# EAGLE design TransmissorTori (EAGLE 9.6.2)
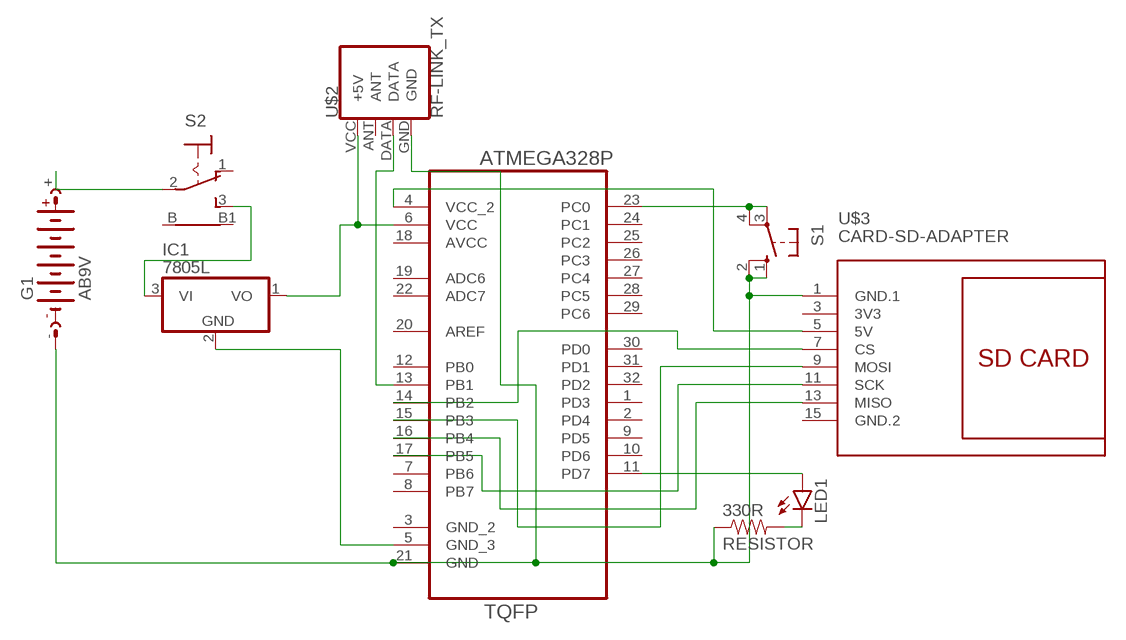
[diagram p0: schematic, sheet 1]

## Parts
330R  RESISTOR  [0603RES]
G1  AB9V  [AB9V]
IC1  7805L  [TO92]
LED1  LED5MM  [LED5MM]
S1  10-XX  [B3F-10XX]
S2  9070-1W  [9070-1W]
U1  ATMEGA328P-AU  [QFP80P900X900X120-32N]
U$2  RF-LINK_TX  [RF-LINK_TX]
U$3  CARD-SD-ADAPTER  [CARD-SD-ADAPTER]

## Nets
N$1: G1.+ S2.2(P)
N$2: IC1.1(VO) U1.6(VCC) U$2.VCC(+5V)
N$3: 330R.1 G1.- S1.1(S) S1.2(S1) U1.21(GND) U$2.GND U$3.1(GND.1)
N$4: U1.15(PB3) U$3.9(MOSI)
N$5: U1.17(PB5) U$3.11(SCK)
N$6: U1.16(PB4) U$3.13(MISO)
N$7: U1.14(PB2) U$3.7(CS)
N$8: U1.4(VCC_2) U$3.5(5V)
N$9: U1.13(PB1) U$2.DATA
N$10: IC1.2(GND) U1.5(GND_3)
N$11: IC1.3(VI) S2.3(S)
N$12: 330R.2 LED1.K(C)
N$13: LED1.A U1.11(PD7)
N$14: S1.3(P) S1.4(P1) U1.23(PC0)
Unconnected: S2.1(O) S2.B S2.B1 U1.1(PD3) U1.2(PD4) U1.3(GND_2) U1.7(PB6) U1.8(PB7) U1.9(PD5) U1.10(PD6) U1.12(PB0) U1.19(ADC6) U1.20(AREF) U1.22(ADC7) U1.24(PC1) U1.25(PC2) U1.26(PC3) U1.27(PC4) U1.28(PC5) U1.29(PC6) U1.30(PD0) U1.31(PD1) U1.32(PD2) U$2.ANT

## Power pins joined to a net without a drawn wire
3V3: U$3.3(3V3)
AVCC: U1.18(AVCC)
GND.2: U$3.15(GND.2)

## Library data of the parts
330R = Ava:RESISTOR
G1 = battery:AB9V: 9-V BATTERY CLIP
IC1 = linear:78*: Positive VOLTAGE REGULATOR Source: http://cache.national.com/ds/LM/LM78L05.pdf http://www.fairchildsemi.com/ds/LM/LM7805.pdf
LED1 = led:LED: LED OSRAM: - CHIPLED LG R971, LG N971, LY N971, LG Q971, LY Q971, LO R971, LY R971 LH N974, LH R974 LS Q976, LO Q976, LY Q976 LO Q996 - Hyper CHIPLED LW Q18S LB Q993, LB Q99A, LB R99A - SideLED LS A670, LO A670, LY A670, LG A670, LP A670 LB A673, LV A673, LT A673, LW A673 LH A674 LY A675 LS A676, LA A676, LO A676, LY A676, LW A676 LS A679, LY A679, LG A679 - Hyper Micro SIDELED® LS Y876, LA Y876, LO Y876, LY Y876 LT Y87S - SmartLED LW L88C, LW L88S LB L89C, LB L89S, LG L890 LS L89K, LO L89K, LY L89K LS L896, LA L896, LO L896, LY L896 - TOPLED LS T670, LO T670, LY T670, LG T670, LP T670 LSG T670, LSP T670, LSY T670, LOP T670, LYG T670 LG T671, LOG T671, LSG T671 LB T673, LV T673, LT T673, LW T673 LH T674 LS T676, LA T676, LO T676, LY T676, LB T676, LH T676, LSB T676, LW T676 LB T67C, LV T67C, LT T67C, LS T67K, LO T67K, LY T67K, LW E67C LS E67B, LA E67B, LO E67B, LY E67B, LB E67C, LV E67C, LT E67C LW T67C LS T679, LY T679, LG T679 LS T770, LO T770, LY T770, LG T770, LP T770 LB T773, LV T773, LT T773, LW T773 LH T774 LS E675, LA E675, LY E675, LS T675 LS T776, LA T776, LO T776, LY T776, LB T776 LHGB T686 LT T68C, LB T68C - Hyper Mini TOPLED® LB M676 - Mini TOPLED Santana® LG M470 LS M47K, LO M47K, LY M47K Source: http://www.osram.convergy.de LUXEON: - LUMILED® LXK2-PW12-R00, LXK2-PW12-S00, LXK2-PW14-U00, LXK2-PW14-V00 LXK2-PM12-R00, LXK2-PM12-S00, LXK2-PM14-U00 LXK2-PE12-Q00, LXK2-PE12-R00, LXK2-PE12-S00, LXK2-PE14-T00, LXK2-PE14-U00 LXK2-PB12-K00, LXK2-PB12-L00, LXK2-PB12-M00, LXK2-PB14-N00, LXK2-PB14-P00, LXK2-PB14-Q00 LXK2-PR12-L00, LXK2-PR12-M00, LXK2-PR14-Q00, LXK2-PR14-R00 LXK2-PD12-Q00, LXK2-PD12-R00, LXK2-PD12-S00 LXK2-PH12-R00, LXK2-PH12-S00 LXK2-PL12-P00, LXK2-PL12-Q00, LXK2-PL12-R00 Source: www.luxeon.com KINGBRIGHT: KA-3528ASYC Source: www.kingbright.com
S1 = switch-omron:10-XX: OMRON SWITCH; MPN: B3F-1000; OC_FARNELL: 176432; OC_NEWARK: 36M3542
S2 = switch:9070-1W: TOGGLE SWITCH Marquardt
U1 = Ava:ATMEGA328P-AU; DESCRIPTION: 8-bit Microcontroller with In-System Programmable Flash; MPN: ATMEGA328P-AU; OC_FARNELL: 1715486; OC_NEWARK: 14R4631; PACKAGE: TQFP-32; SUPPLIER: Atmel
U$2 = SparkFun-RF:RF-LINK_TX: RF Link Transmitter (434 MHz, 315 MHz) These wireless transmitters work with equivalent receivers. They can easily fit into a breadboard and work well with microcontrollers to create a very simple wireless data link. Since these are only transmitters, they will only work communicating data one-way, you would need two pairs (of different frequencies) to act as a transmitter/receiver pair. SparkFun Products RF Link Transmitter - 434MHz <https://www.sparkfun.com/products/10534> (WRL-10534); SF_ID: WRL-10534
U$3 = diy-modules:CARD-SD-ADAPTER: Full Size SD Card Adapter Module with onboard 3.3V regulator

## Board
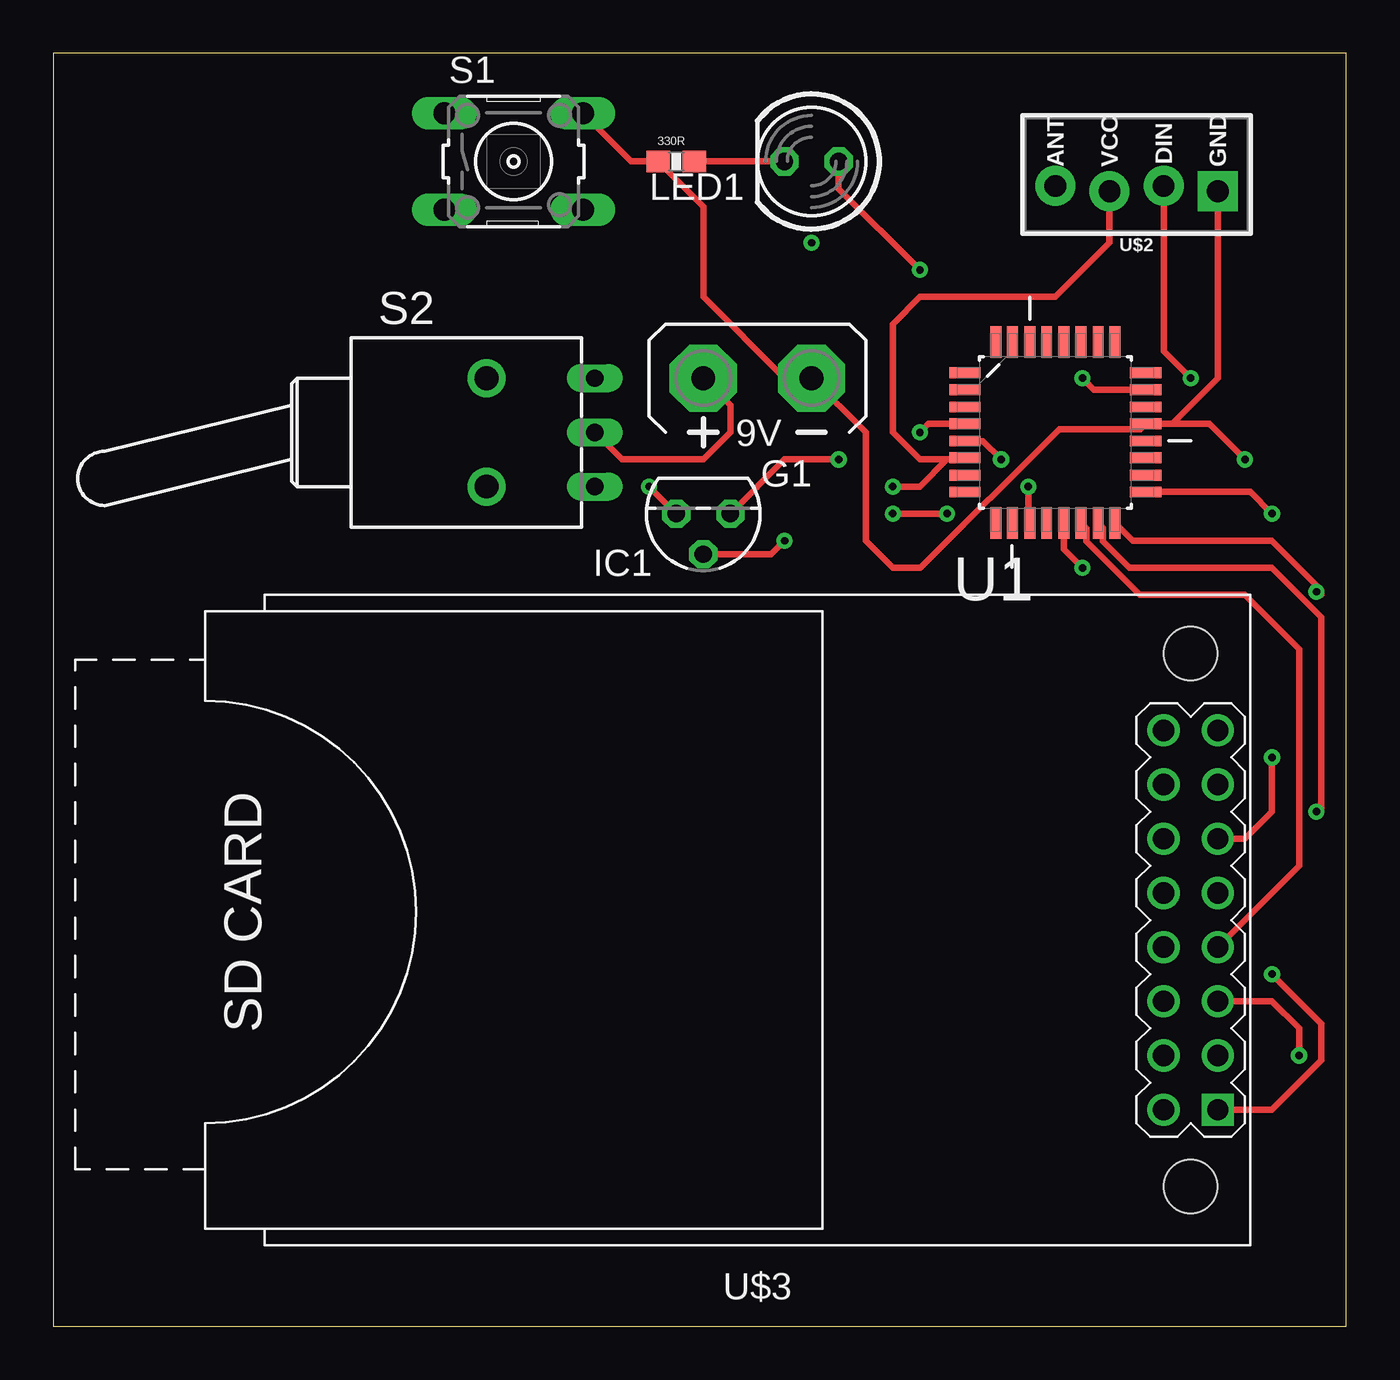
[diagram p1: board, top side]
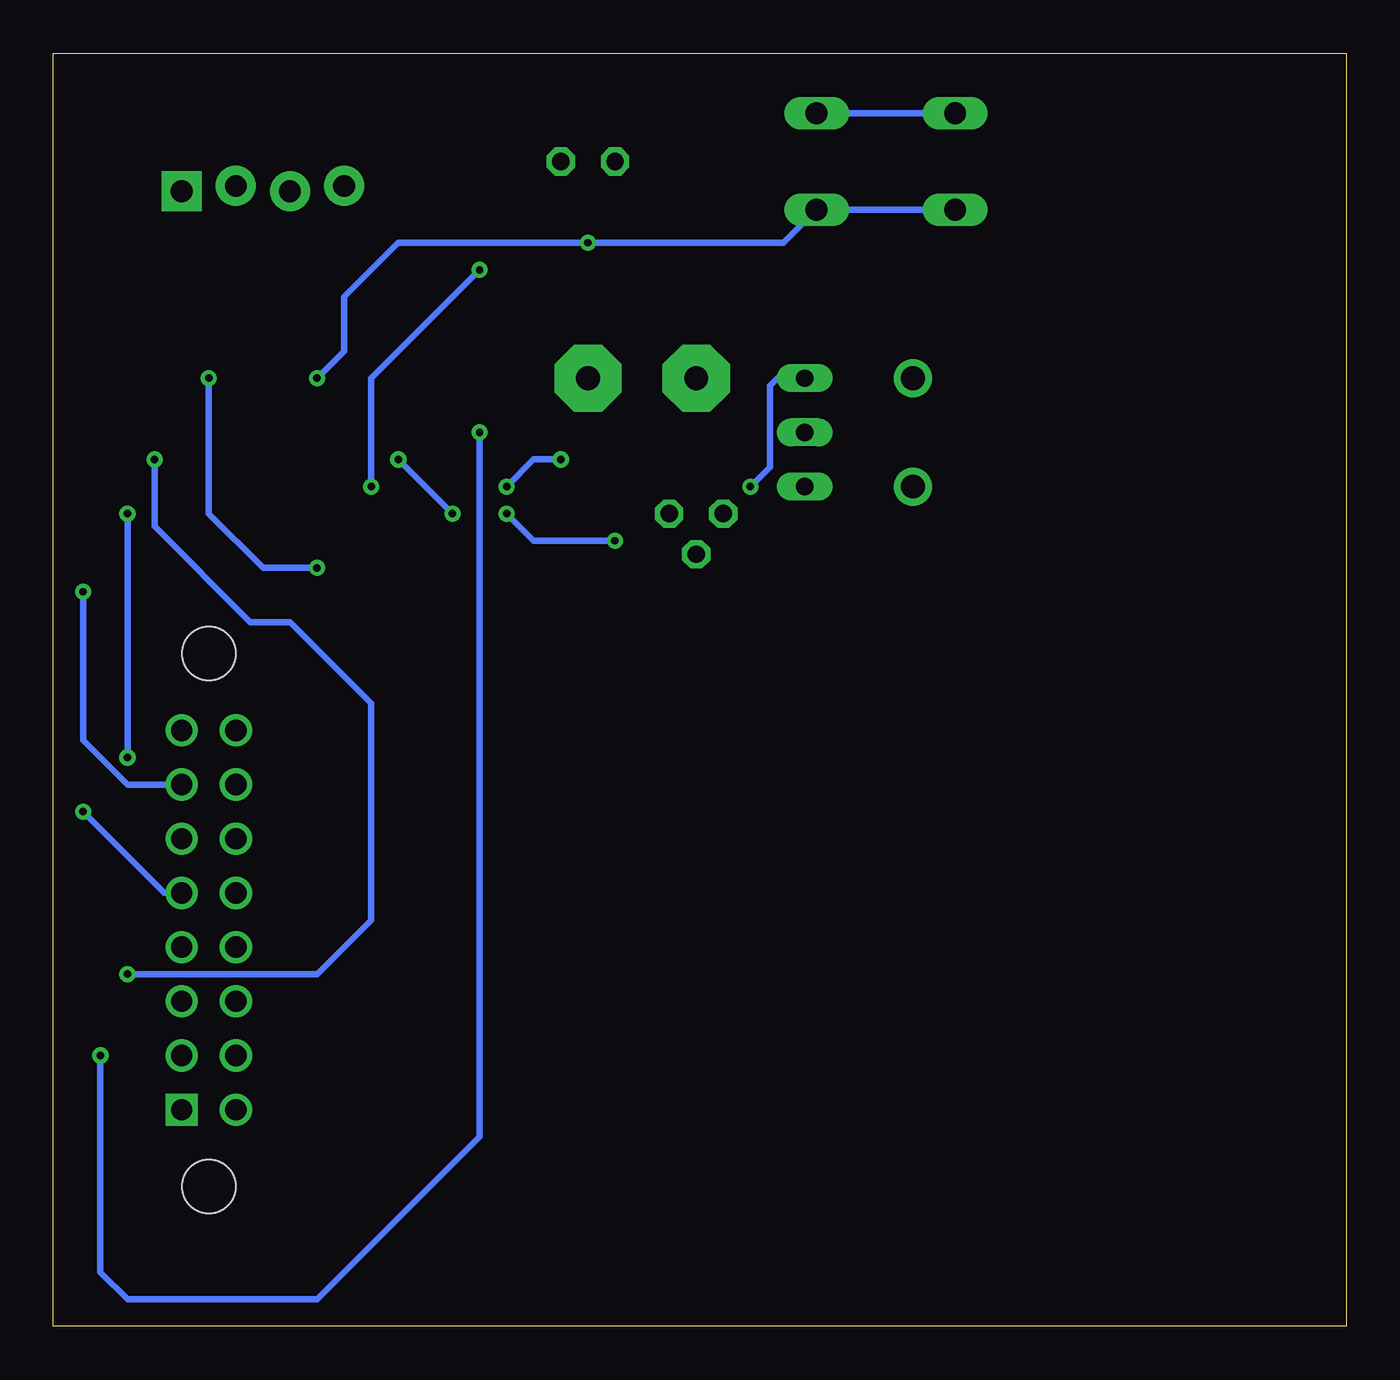
[diagram p2: board, bottom side, seen from below]

Size 60.63 x 59.68 mm. Coordinates in mm from the lower left corner, seen from the top.
Outline: 0,0 60.63,0 60.63,59.68 0,59.68 0,0
Copper layers (1*16): Top 0.035mm / dielectric 1.5mm / Bottom 0.035mm
Design rules "default": minimum track width 6mil, minimum drill 0.35mm, track to track 6mil, track to pad 6mil, pad to pad 6mil, via to via 6mil, smd to smd 6mil, copper to edge 40mil, drill to drill 6mil, minimum pad ring 10mil, minimum via ring 8mil, stop-mask expansion 4mil, vias tented up to drill 0mil, thermal gap 10mil

### Footprints (pad centres in the part's own frame; a part is rotated, then mirrored left to right if it is on the bottom)
0603RES = smd 1.1 x 1: 1 -0.85,0; 2 0.85,0
AB9V = drill 1.118 pad 3.15 octagon: + 0,2.54; - 0,-2.54
TO92 = drill 0.813 octagon: 1 -1.27,0; 2 0,1.905; 3 1.27,0
LED5MM = drill 0.813 octagon: A -1.27,0; K 1.27,0
B3F-10XX = drill 1.016 long: 1 -3.251,2.261; 2 3.251,2.261; 3 -3.251,-2.261; 4 3.251,-2.261
9070-1W = drill 0.813 long: 1 5.08,-2.54; 2 5.08,0; 3 5.08,2.54 | drill 1.118 pad 1.778: B 0,-2.54; B1 0,2.54
QFP80P900X900X120-32N = smd 1.473 x 0.508: 1 -4.242,2.794; 2 -4.242,2.007; 3 -4.242,1.194; 4 -4.242,0.406; 5 -4.242,-0.406; 6 -4.242,-1.194; 7 -4.242,-2.007; 8 -4.242,-2.794; 17 4.242,-2.794; 18 4.242,-2.007; 19 4.242,-1.194; 20 4.242,-0.406; 21 4.242,0.406; 22 4.242,1.194; 23 4.242,2.007; 24 4.242,2.794 | smd 0.508 x 1.473: 9 -2.794,-4.242; 10 -2.007,-4.242; 11 -1.194,-4.242; 12 -0.406,-4.242; 13 0.406,-4.242; 14 1.194,-4.242; 15 2.007,-4.242; 16 2.794,-4.242; 25 2.794,4.242; 26 2.007,4.242; 27 1.194,4.242; 28 0.406,4.242; 29 -0.406,4.242; 30 -1.194,4.242; 31 -2.007,4.242; 32 -2.794,4.242
RF-LINK_TX = drill 1.016 pad 1.88: ANT 3.81,-0.127; DATA -1.27,-0.127; VCC 1.27,0.127 | drill 1.016 pad 1.88 square: GND -3.81,0.127
CARD-SD-ADAPTER = drill 1 square: 1 -21.59,8.89 | drill 1: 2 -19.05,8.89; 3 -21.59,6.35; 4 -19.05,6.35; 5 -21.59,3.81; 6 -19.05,3.81; 7 -21.59,1.27; 8 -19.05,1.27; 9 -21.59,-1.27; 10 -19.05,-1.27; 11 -21.59,-3.81; 12 -19.05,-3.81; 13 -21.59,-6.35; 14 -19.05,-6.35; 15 -21.59,-8.89; 16 -19.05,-8.89 | hole 2.5: -20.32,12.5; -20.32,-12.5

### Placement (x,y rotation side)
330R  29.21,54.61 0 top
G1  33.02,44.45 90 top
IC1  30.48,38.1 180 top
LED1  35.56,54.61 180 top
S1  21.59,54.61 0 top
S2  20.32,41.91 0 top
U1  46.99,41.91 0 top
U$2  50.8,53.34 180 top
U$3  33.02,19.05 180 top

### Tracks (layer width: path | path; a pad name or v marks a point on that pad's centre or on a via)
N$1
  Top 0.305: S2.2 26.67,40.64 30.48,40.64 31.75,41.91 31.75,43.18 G1.+
N$2  (via drill 0.35)
  Top 0.305: U$2.VCC 49.53,50.8 46.99,48.26 40.64,48.26 39.37,46.99 39.37,41.91 40.64,40.64 41.91,40.64 | 41.91,40.64 42.67,40.64 U1.6 | IC1.1 34.29,40.64 v36.83,40.64 | v39.37,39.37 40.64,39.37 41.91,40.64
  Bottom 0.305: v36.83,40.64 38.1,40.64 v39.37,39.37
N$3  (via drill 0.35)
  Top 0.305: 52.48,42.32 U1.21 50.98,42.06 47.17,42.06 40.67,35.56 39.37,35.56 38.1,36.83 38.1,41.91 G1.- 34.29,44.45 30.48,48.26 30.48,52.49 330R.1 27.1,54.61 S1.2 | 52.48,42.32 54.61,44.45 U$2.GND | U$3.1 57.15,10.16 59.46,12.47 59.46,14.2 v57.15,16.51 | 52.48,42.32 54.2,42.32 v55.88,40.64
  Bottom 0.305: S1.1 S1.2 | v57.15,16.51 48.26,16.51 45.72,19.05 45.72,29.21 49.53,33.02 51.39,33.02 55.88,37.51 v55.88,40.64
N$4  (via drill 0.35)
  Top 0.305: U1.15 49.23,37.44 49.23,36.8 50.47,35.56 57.15,35.56 59.46,33.25 59.46,24.13 v59.24,24.13
  Bottom 0.305: v59.24,24.13 55.43,20.32 U$3.9
N$5  (via drill 0.35)
  Top 0.305: U1.17 56.13,39.12 v57.15,38.1 | v57.15,26.67 57.15,24.13 55.88,22.86 U$3.11
  Bottom 0.305: v57.15,38.1 57.15,29.21 57.15,28.98 v57.15,26.67
N$6  (via drill 0.35)
  Top 0.305: U1.16 50.62,36.83 57.15,36.83 59.46,34.52 59.46,34.29 59.39,34.29 v59.24,34.44
  Bottom 0.305: v59.24,34.44 59.24,27.49 57.15,25.4 U$3.13
N$7
  Top 0.305: U1.14 48.44,37.41 48.44,36.8 50.95,34.29 55.88,34.29 58.42,31.75 58.42,21.59 U$3.7
N$8  (via drill 0.35)
  Top 0.305: U1.4 41.05,42.32 v40.64,41.91 | U$3.5 57.15,15.24 58.42,13.97 v58.42,12.7
  Bottom 0.305: v40.64,41.91 40.64,8.89 48.26,1.27 57.15,1.27 58.42,2.54 v58.42,12.7
N$9  (via drill 0.35)
  Top 0.305: U$2.DATA 52.07,45.72 v53.34,44.45 | U1.13 47.4,36.42 v48.26,35.56
  Bottom 0.305: v48.26,35.56 50.8,35.56 53.34,38.1 v53.34,44.45
N$10  (via drill 0.35)
  Top 0.305: U1.5 43.59,41.5 v44.45,40.64 | v41.91,38.1 v39.37,38.1 | v34.29,36.83 33.66,36.2 IC1.2
  Bottom 0.305: v44.45,40.64 v41.91,38.1 | v39.37,38.1 38.1,36.83 v34.29,36.83
N$11  (via drill 0.35)
  Top 0.305: IC1.3 v27.94,39.37
  Bottom 0.305: v27.94,39.37 27.03,40.28 27.03,44.09 26.67,44.45 S2.3
N$12
  Top 0.305: 330R.2 33.02,54.61 33.32,54.61 LED1.K
N$13  (via drill 0.35)
  Top 0.305: 45.72,37.59 U1.11 45.72,37.74 v45.72,39.37 | v40.64,49.53 36.83,53.34 LED1.A
  Bottom 0.305: v45.72,39.37 45.72,44.45 v40.64,49.53
N$14  (via drill 0.35)
  Top 0.305: U1.23 48.79,43.92 v48.26,44.45
  Bottom 0.305: v48.26,44.45 46.99,45.72 46.99,48.26 44.45,50.8 v35.56,50.8 26.39,50.8 25.26,51.93 S1.4 S1.3